# EAGLE schematic GiGa_keyboard (EAGLE 7.1.0)
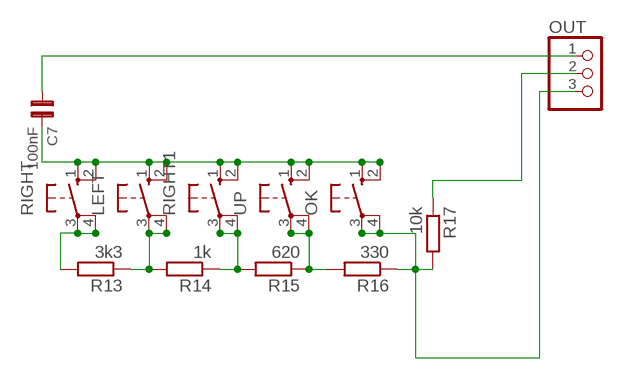
[diagram p0: schematic, sheet 1]

## Parts
C7  100nF  C1206  [1206]
LEFT  10-XX  [B3F-10XX]
OK  10-XX  [B3F-10XX]
OUT  PINHD-1X3  [1X03]
R13  3k3  R-EU_R1206  [R1206]
R14  1k  R-EU_R1206  [R1206]
R15  620  R-EU_R1206  [R1206]
R16  330  R-EU_R1206  [R1206]
R17  10k  R-EU_R1206  [R1206]
RIGHT  10-XX  [B3F-10XX]
RIGHT1  10-XX  [B3F-10XX]
UP  10-XX  [B3F-10XX]

## Nets
+5V: OUT.2 R17.1
ANALOG: OK.3(P) OK.4(P1) OUT.3 R16.1 R17.2
GND: C7.1 OUT.1
N$15: C7.2 LEFT.1(S) LEFT.2(S1) OK.1(S) OK.2(S1) RIGHT1.1(S) RIGHT1.2(S1) RIGHT.1(S) RIGHT.2(S1) UP.1(S) UP.2(S1)
N$31: R13.2 RIGHT.3(P) RIGHT.4(P1)
N$36: LEFT.3(P) LEFT.4(P1) R13.1 R14.2
N$37: R14.1 R15.2 RIGHT1.3(P) RIGHT1.4(P1)
N$38: R15.1 R16.2 UP.3(P) UP.4(P1)

## Library data of the parts
C7 = capsmd:C1206
LEFT OK RIGHT RIGHT1 UP = switch-omron:10-XX: OMRON SWITCH; MPN: B3F-1000; OC_FARNELL: 176432; OC_NEWARK: 36M3542
OUT = pinhead:PINHD-1X3: PIN HEADER
R13-R17 = rcl:R-EU_: RESISTOR, European symbol